# Altium schematic sheet MCU_Sheet.SchDoc
size A2; SheetNumber: 3; SheetTotal: 5
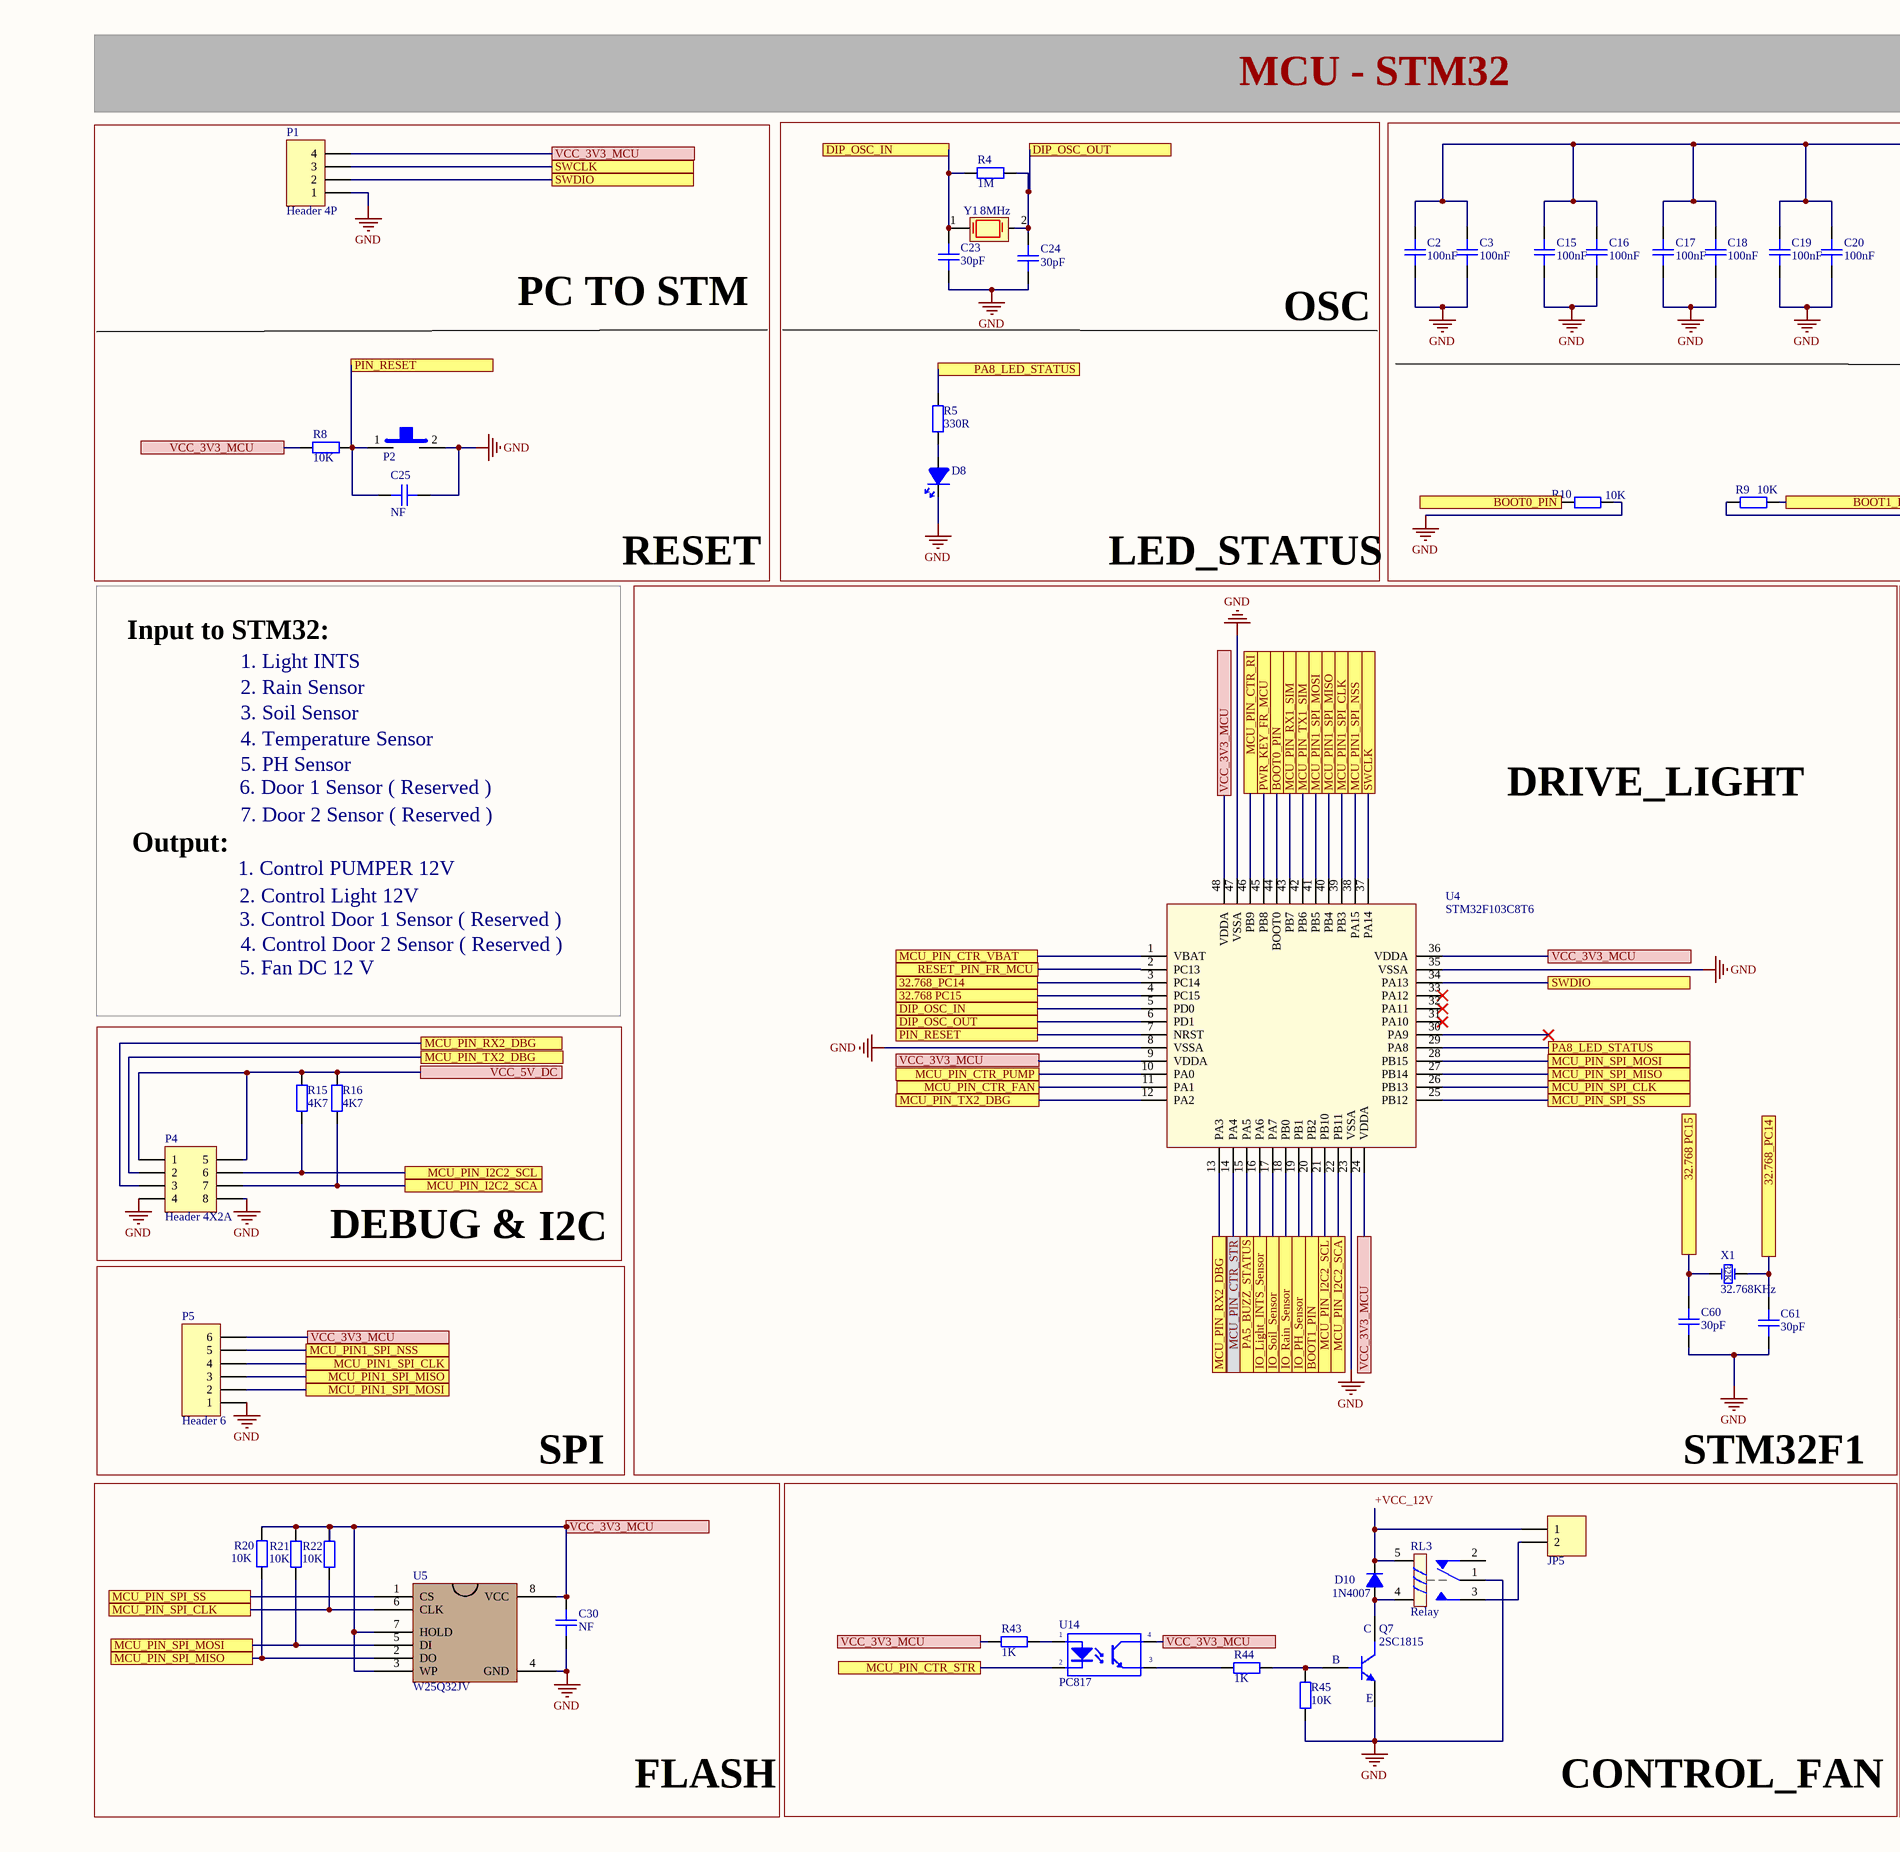
[diagram p0: MCU_Sheet.SchDoc, left]
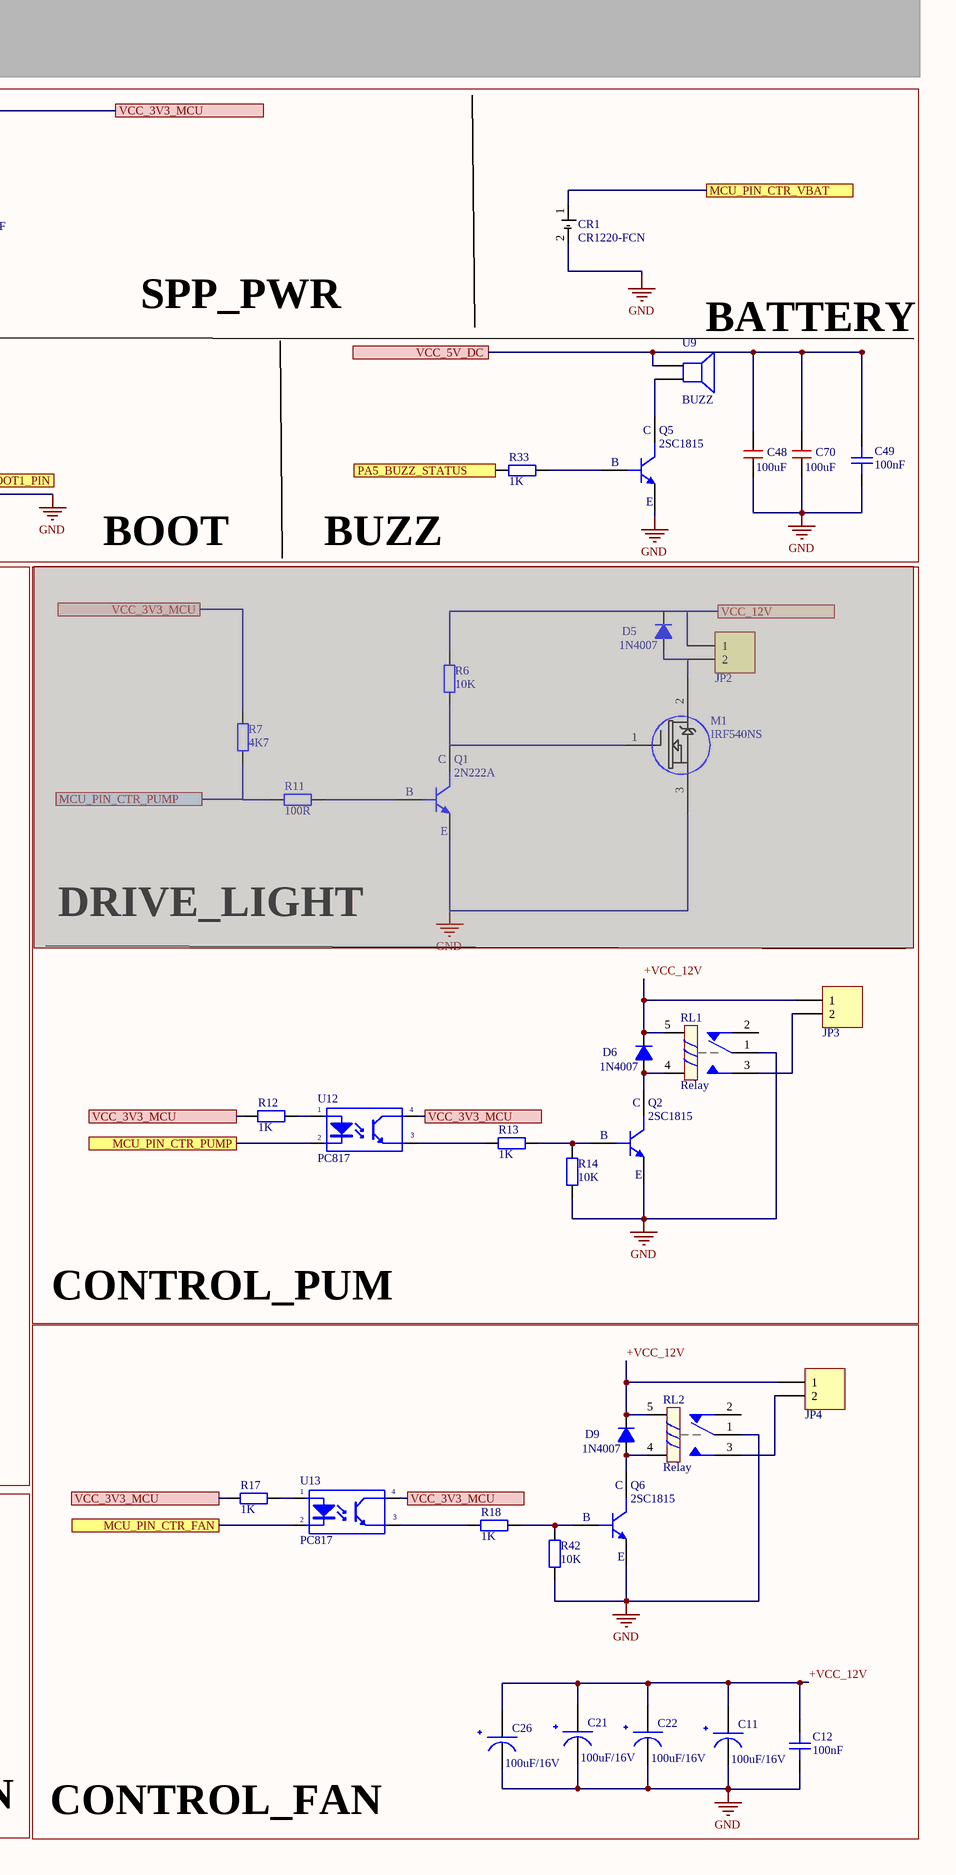
[diagram p1: MCU_Sheet.SchDoc, right]

## Parts
C2  100nF  [CAPC-0603 (1608)]
C3  100nF  [CAPC-0603 (1608)]
C11  100uF/16V  [CAP 6.3MMx5.4MM]
C12  100nF  [CAPC-0603 (1608)]
C15  100nF  [CAPC-0603 (1608)]
C16  100nF  [CAPC-0603 (1608)]
C17  100nF  [CAPC-0603 (1608)]
C18  100nF  [CAPC-0603 (1608)]
C19  100nF  [CAPC-0603 (1608)]
C20  100nF  [CAPC-0603 (1608)]
C21  100uF/16V  [CAP 6.3MMx5.4MM]
C22  100uF/16V  [CAP 6.3MMx5.4MM]
C23  30pF  [CAPC-0603 (1608)]
C24  30pF  [CAPC-0603 (1608)]
C25  NF  [CAPC-0603 (1608)]
C26  100uF/16V  [CAP 6.3MMx5.4MM]
C30  NF  [CAPC-0603 (1608)]
C48  100uF  [100uF 1210 SMD]
C49  100nF  [CAPC-0603 (1608)]
C60  30pF  [CAPC-0603 (1608)]
C61  30pF  [CAPC-0603 (1608)]
C70  100uF  [100uF 1210 SMD]
CR1  CR1220-FCN  [CR1220]
D5  1N4007  [DO-214AC]  (masked out: inside a compile mask, not in the netlist)
D6  1N4007  [DO-214AC]
D8  LED_0805_PW  [LED_0805_PW]  (value not drawn)
D9  1N4007  [DO-214AC]
D10  1N4007  [DO-214AC]
JP2  Header 2_1  [HED2]  (value not drawn)  (masked out: inside a compile mask, not in the netlist)
JP3  Header 2_1  [HED2]  (value not drawn)
JP4  Header 2_1  [HED2]  (value not drawn)
JP5  Header 2_1  [HED2]  (value not drawn)
M1  IRF540NS  [IRF540NS]  (masked out: inside a compile mask, not in the netlist)
P1  Header 4P  [HDR1X4]
P2  (no value)  [SW 2P SMD]
P4  Header 4X2A  [HDR2X4_CEN]
P5  Header 6  [HDR1X6]
Q1  2N222A  [SOT23_3]  (masked out: inside a compile mask, not in the netlist)
Q2  2SC1815  [SOT23_3]
Q5  2SC1815  [SOT23_3]
Q6  2SC1815  [SOT23_3]
Q7  2SC1815  [SOT23_3]
R4  1M  [RESC-0603 (1608)]
R5  330R  [RESC-0603 (1608)]
R6  10K  [RESC-0603 (1608)]  (masked out: inside a compile mask, not in the netlist)
R7  4K7  [RESC-0603 (1608)]  (masked out: inside a compile mask, not in the netlist)
R8  10K  [RESC-0603 (1608)]
R9  10K  [RESC-0603 (1608)]
R10  10K  [RESC-0603 (1608)]
R11  100R  [RESC-0603 (1608)]  (masked out: inside a compile mask, not in the netlist)
R12  1K  [RESC-0603 (1608)]
R13  1K  [RESC-0603 (1608)]
R14  10K  [RESC-0603 (1608)]
R15  4K7  [RESC-0603 (1608)]
R16  4K7  [RESC-0603 (1608)]
R17  1K  [RESC-0603 (1608)]
R18  1K  [RESC-0603 (1608)]
R20  10K  [RESC-0603 (1608)]
R21  10K  [RESC-0603 (1608)]
R22  10K  [RESC-0603 (1608)]
R33  1K  [RESC-0603 (1608)]
R42  10K  [RESC-0603 (1608)]
R43  1K  [RESC-0603 (1608)]
R44  1K  [RESC-0603 (1608)]
R45  10K  [RESC-0603 (1608)]
RL1  Relay  [RL_SPDT_10A]
RL2  Relay  [RL_SPDT_10A]
RL3  Relay  [RL_SPDT_10A]
U4  STM32F103C8T6  [STM32F103C8T6]
U5  W25Q32JV  [W2Q532JV]
U9  BUZZ  [BUZZER_through_hole]
U12  PC817  [DIP4/W0.3]
U13  PC817  [DIP4/W0.3]
U14  PC817  [DIP4/W0.3]
X1  32.768KHz  [Crystal_ABS07_SMD-3.2x1.5MM]
Y1  8MHz  [CRYSTAL - 8Mhz]

## Ports
32.768 PC15, 32.768_PC14, BOOT0_PIN, BOOT1_PIN, DIP_OSC_IN, DIP_OSC_OUT, IO_Light_INTS_Sensor, IO_PH_Sensor, IO_Rain_Sensor, IO_Soil_Sensor, MCU_PIN1_SPI_CLK, MCU_PIN1_SPI_MISO, MCU_PIN1_SPI_MOSI, MCU_PIN1_SPI_NSS, MCU_PIN_CTR_FAN, MCU_PIN_CTR_PUMP, MCU_PIN_CTR_RI, MCU_PIN_CTR_STR, MCU_PIN_CTR_VBAT, MCU_PIN_I2C2_SCA, MCU_PIN_I2C2_SCL, MCU_PIN_RX1_SIM, MCU_PIN_RX2_DBG, MCU_PIN_SPI_CLK, MCU_PIN_SPI_MISO, MCU_PIN_SPI_MOSI, MCU_PIN_SPI_SS, MCU_PIN_TX1_SIM, MCU_PIN_TX2_DBG, PA5_BUZZ_STATUS, PA8_LED_STATUS, PIN_RESET, PWR_KEY_FR_MCU, RESET_PIN_FR_MCU, SWCLK, SWDIO, VCC_3V3_MCU, VCC_5V_DC, VCC_12V

## Nets
GND: C2.1 C3.1 C11.2 C12.1 C15.1 C16.1 C17.1 C18.1 C19.1 C20.1 C21.2 C22.2 C23.1 C24.1 C25.1 C26.2 C30.1 C48.1 C49.1 C60.2 C61.2 C70.1 CR1.2 D8.2(K) P1.1 P2.2 P4.4 P4.8 P5.1 Q2.2(E) Q5.2(E) Q6.2(E) Q7.2(E) R9.1 R10.2 R14.1 R42.1 R45.1 RL1.1 RL2.1 RL3.1 U4.8(VSSA) U4.23(VSSA) U4.35(VSSA) U4.47(VSSA) U5.4(GND)
32.768 PC15: C60.1 U4.4(PC15) X1.2(OSC2) ; port 32.768 PC15
32.768_PC14: C61.1 U4.3(PC14) X1.1(OSC1) ; port 32.768_PC14
+VCC_12V: C11.1 C12.2 C21.1 C22.1 C26.1 D6.K D9.K D10.K JP3.1 JP4.1 JP5.1 RL1.5 RL2.5 RL3.5
BOOT0_PIN: R10.1 U4.44(BOOT0) ; port BOOT0_PIN
BOOT1_PIN: R9.2 U4.20(PB2) ; port BOOT1_PIN
DIP_OSC_IN: C23.2 R4.2 U4.5(PD0) Y1.1 ; port DIP_OSC_IN
DIP_OSC_OUT: C24.2 R4.1 U4.6(PD1) Y1.2 ; port DIP_OSC_OUT
IO_Light_INTS_Sensor: U4.16(PA6) ; port IO_Light_INTS_Sensor
IO_PH_Sensor: U4.19(PB1) ; port IO_PH_Sensor
IO_Rain_Sensor: U4.18(PB0) ; port IO_Rain_Sensor
IO_Soil_Sensor: U4.17(PA7) ; port IO_Soil_Sensor
MCU_PIN1_SPI_CLK: P5.4 U4.39(PB3) ; port MCU_PIN1_SPI_CLK
MCU_PIN1_SPI_MISO: P5.3 U4.40(PB4) ; port MCU_PIN1_SPI_MISO
MCU_PIN1_SPI_MOSI: P5.2 U4.41(PB5) ; port MCU_PIN1_SPI_MOSI
MCU_PIN1_SPI_NSS: P5.5 U4.38(PA15) ; port MCU_PIN1_SPI_NSS
MCU_PIN_CTR_FAN: U4.11(PA1) U13.2(K) ; port MCU_PIN_CTR_FAN
MCU_PIN_CTR_PUMP: U4.10(PA0) U12.2(K) ; port MCU_PIN_CTR_PUMP
MCU_PIN_CTR_RI: U4.46(PB9) ; port MCU_PIN_CTR_RI
MCU_PIN_CTR_STR: U4.14(PA4) U14.2(K) ; port MCU_PIN_CTR_STR
MCU_PIN_CTR_VBAT: CR1.1 U4.1(VBAT) ; port MCU_PIN_CTR_VBAT
MCU_PIN_I2C2_SCA: P4.7 R16.2 U4.22(PB11) ; port MCU_PIN_I2C2_SCA
MCU_PIN_I2C2_SCL: P4.6 R15.2 U4.21(PB10) ; port MCU_PIN_I2C2_SCL
MCU_PIN_RX1_SIM: U4.43(PB7) ; port MCU_PIN_RX1_SIM
MCU_PIN_RX2_DBG: P4.3 U4.13(PA3) ; port MCU_PIN_RX2_DBG
MCU_PIN_SPI_CLK: R22.1 U4.26(PB13) U5.6(CLK) ; port MCU_PIN_SPI_CLK
MCU_PIN_SPI_MISO: R20.1 U4.27(PB14) U5.2(DO) ; port MCU_PIN_SPI_MISO
MCU_PIN_SPI_MOSI: R21.1 U4.28(PB15) U5.5(DI) ; port MCU_PIN_SPI_MOSI
MCU_PIN_SPI_SS: U4.25(PB12) U5.1(CS) ; port MCU_PIN_SPI_SS
MCU_PIN_TX1_SIM: U4.42(PB6) ; port MCU_PIN_TX1_SIM
MCU_PIN_TX2_DBG: P4.2 U4.12(PA2) ; port MCU_PIN_TX2_DBG
PA5_BUZZ_STATUS: R33.1 U4.15(PA5) ; port PA5_BUZZ_STATUS
PA8_LED_STATUS: R5.1 U4.29(PA8) ; port PA8_LED_STATUS
PIN_RESET: C25.2 P2.1 R8.2 U4.7(NRST) ; port PIN_RESET
PWR_KEY_FR_MCU: U4.45(PB8) ; port PWR_KEY_FR_MCU
RESET_PIN_FR_MCU: U4.2(PC13) ; port RESET_PIN_FR_MCU
SWCLK: P1.3 U4.37(PA14) ; port SWCLK
SWDIO: P1.2 U4.34(PA13) ; port SWDIO
VCC_3V3_MCU: C2.2 C3.2 C15.2 C16.2 C17.2 C18.2 C19.2 C20.2 C30.2 P1.4 P5.6 R8.1 R12.2 R17.2 R20.2 R21.2 R22.2 R43.2 U4.9(VDDA) U4.24(VDDA) U4.36(VDDA) U4.48(VDDA) U5.3(WP) U5.7(HOLD) U5.8(VCC) U12.4(C) U13.4(C) U14.4(C) ; port VCC_3V3_MCU
VCC_5V_DC: C48.2 C49.2 C70.2 P4.1 P4.5 R15.1 R16.1 U9.1 ; port VCC_5V_DC
NetD6_A: D6.A Q2.3(C) RL1.4
NetD8_1: D8.1(A) R5.2
NetD9_A: D9.A Q6.3(C) RL2.4
NetD10_A: D10.A Q7.3(C) RL3.4
NetJP3_2: JP3.2 RL1.3
NetJP4_2: JP4.2 RL2.3
NetJP5_2: JP5.2 RL3.3
NetQ2_1: Q2.1(B) R13.2 R14.2
NetQ5_1: Q5.1(B) R33.2
NetQ5_3: Q5.3(C) U9.2
NetQ6_1: Q6.1(B) R18.2 R42.2
NetQ7_1: Q7.1(B) R44.2 R45.2
NetR12_1: R12.1 U12.1(A)
NetR13_1: R13.1 U12.3(E)
NetR17_1: R17.1 U13.1(A)
NetR18_1: R18.1 U13.3(E)
NetR43_1: R43.1 U14.1(A)
NetR44_1: R44.1 U14.3(E)

Not connected (* = marked no-connect by the designer): RL1 2; RL2 2; RL3 2; U4 30(PA9)* 31(PA10)* 32(PA11)* 33(PA12)*

## Notes on the sheet
- MCU - STM32
- PC TO STM
- OSC
- SPP_PWR
- (near U9) BATTERY
- RESET
- LED_STATUS
- BOOT
- BUZZ
- Input to STM32:
- 1. Light INTS
- 2. Rain Sensor
- 3. Soil Sensor
- 4. Temperature Sensor
- 6. Door 1 Sensor ( Reserved )
- 5. PH Sensor
- DRIVE_LIGHT
- Output:
- 1. Control PUMPER 12V
- 7. Door 2 Sensor ( Reserved )
- 2. Control Light 12V
- 3. Control Door 1 Sensor ( Reserved )
- 5. Fan DC 12 V
- 4. Control Door 2 Sensor ( Reserved )
- DEBUG &
- I2C
- CONTROL_PUM
- SPI
- STM32F1
- FLASH
- CONTROL_FAN
- (in symbol ABS07-32.768KHZ-T) 32K

## Library data of the parts
C2 C3 C12 C15-C20 C23 C24 C49 C60 C61 = CAPC NF 0603: CAP SMD, Not Fill, 0603; Value: NF; Solder: Not Fill; Category: CAPACITOR
C11 C21 C22 C26 = CAP 100uF: Capacitor 100uF - 16V. Size 6.3x5.4mm
C25 C30 = CAPC NF 0603: CAP SMD, Not Fill, 0603; Solder: Not Fill; Value: NF; Category: CAPACITOR
C48 C70 = CAP SMD 1210 100uF
D5 D6 D9 D10 = Diode  1N4007: Diode 1A; Value: 1N4007
JP2-JP5 = Header 2_1: Header, 2-Pin; Manufacturer: Generic Components; Class: Connector; Value: Header 2
P1 = Header 4x1: Header, 4 Pin Pitch 2.54mm; MPN: S1012EC-40-ND; CompanyID: VT-00125; Solder: WAVE; Value: Header 4P
P2 = Button 2 SMD: SMD Mini Push Button Switch 2 Pin 3x6x2.7mm; MPN: SMD Mini Push Button 2 SMD; Link: https://ram-e-shop.com/product/press2pin-smd/
P4 = Header 4X2A: Header, 4-Pin, Dual row; Solder: WAVE
P5 = Header 6: Header, 6-Pin; Solder: WAVE
Q1 Q2 Q5-Q7 = 2SC1815: TRANS NPN 50V 0.15A SOT23-3; Solder: SMT; MPN: 2SC1815; Value: 2SC1815
R4-R18 R20-R22 R33 R42-R45 = CRCW06035R10FKEA: RES SMD 5.1 OHM 1% 1/10W 0603; MFR: Vishay Dale; Value: 5.1R; Solder: SMT; MPN: CRCW06035R10FKEA; Category: RESISTOR; PinCount: 2
RL1-RL3 = Relay SRD: Relay SPDT 5 Pin; Value: Relay SPDT, 10A, 12V
U9 = Speaker: Loudspeaker
U12-U14 = PC817: Single Opto; Value: PC817
X1 = ABS07-32.768KHZ-T: CRYSTAL 32.7680KHZ 12.5pF SMD; Solder: SMT; CompanyID: VT-01153; MPN: ABS07-32.768KHZ-T; Value: 32.768KHz; Category: CRYSTAL
Y1 = CRYSTAL - 8MHZ